# Altium schematic sheet Power_v2.SchDoc
size A
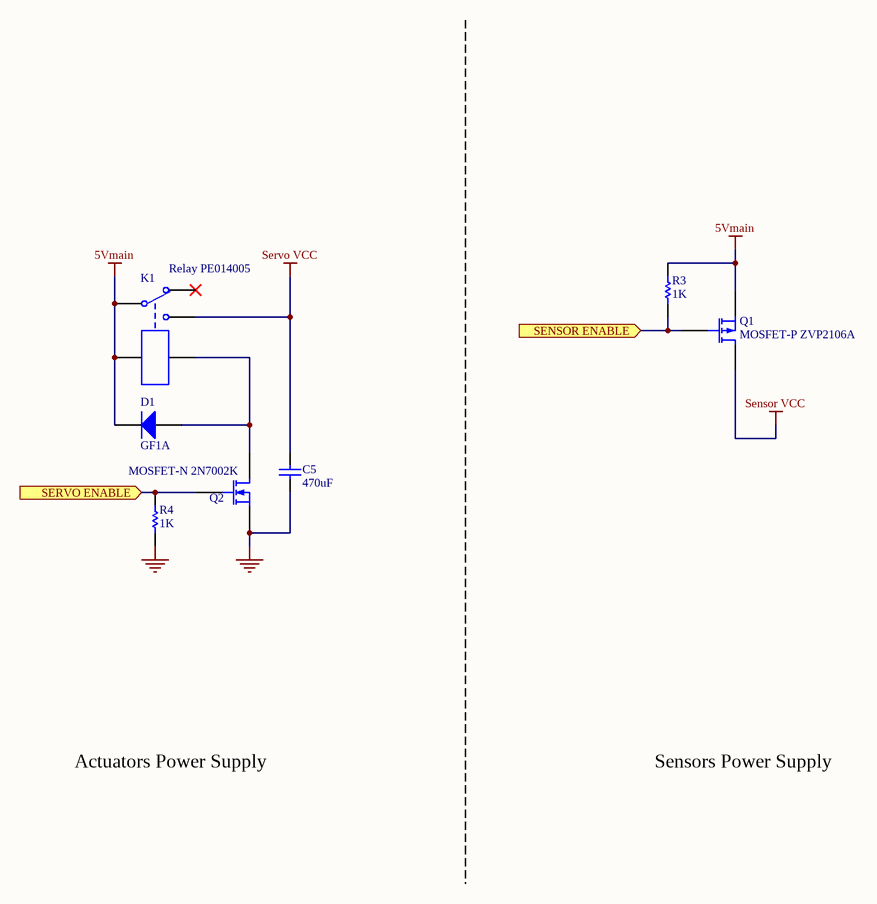
[diagram p0: Power_v2.SchDoc]

## Parts
C5  470uF  [CONDO_D_10mm]
D1  GF1A  [SMA/DO-214AC_21]
K1  Relay PE014005  [PE014005]
Q1  MOSFET-P ZVP2106A  [SOT23]
Q2  MOSFET-N 2N7002K  [SOT23]
R3  1K  [1608 / 0603]
R4  1K  [1608 / 0603]

## Ports
SENSOR ENABLE (in), SERVO ENABLE (in)

## Nets
5Vmain: D1.2(K) K1.12 K1.A2 Q1.3(S) R3.2
GND: C5.1 Q2.2(G) R4.1
Sensor VCC: Q1.1(D)
Servo VCC: C5.2 K1.11
SENSOR ENABLE: Q1.2(G) R3.1 ; port SENSOR ENABLE
SERVO ENABLE: Q2.1(D) R4.2 ; port SERVO ENABLE
NetD1_1: D1.1(A) K1.A1 Q2.3(S)

Not connected (* = marked no-connect by the designer): K1 14*

## Notes on the sheet
- Actuators Power Supply
- Sensors Power Supply

## Library data of the parts
C5 = Cap: Capacitor; fabricant: Panasonic; fournisseur: Farnell; reffabricant: ECA-1EHG471; reffournisseur: 9692843; Published: 8-Jun-2000; LatestRevisionDate: 17-Jul-2002; LatestRevisionNote: Re-released for DXP Platform.; PackageReference: RAD-0.3; Publisher: Altium Limited; PackageDescription: Radial Cap, Thru-Hole; 2 Leads; 0.3 in Pin Spacing
D1 = Diode: Default Diode; fournisseur: Farnell; reffournisseur: 9549560; fabricant: VISHAY; reffabricant: GF1A-E3/67A; Published: 8-Jun-2000; LatestRevisionDate: 17-Jul-2002; LatestRevisionNote: Re-released for DXP Platform.; PackageVersion: Sep-1996; PackageReference: SMC; Publisher: Altium Limited; PackageDescription: DO-214-AB/SMC; 2 C-Bend Leads; Body 7.9 x 5.9 mm, inc. leads (LxW); Code_JEDEC: DO-214-AB
K1 = Relay-SPDT: Relay; fournisseur: Farnell; reffournisseur: 1175088; fabricant: TE CONNECTIVITY / SCHRACK; Published: 24-Mar-1999; LatestRevisionDate: 17-Jul-2002; LatestRevisionNote: Re-released for DXP Platform.; PackageReference: MODULE5B; Publisher: Altium Limited; reffabricant: PE014005
Q1 = MOSFET-P: P-Channel MOSFET; fournisseur: Farnell; reffournisseur: 9525505; fabricant: DIODES INC; Published: 8-Jun-2000; LatestRevisionDate: 17-Jul-2002; LatestRevisionNote: Re-released for DXP Platform.; PackageVersion: 1995/1996; PackageReference: E3; Publisher: Altium Limited; PackageDescription: TO, Flat Index; 3 In-Line, Axial Leads; Body Dia. 4.6mm; Lead Dia. 0.5 mm (max); reffabricant: ZVP2106A
Q2 = MOSFET-N: N-Channel MOSFET; fournisseur: Farnell; reffournisseur: 2453382; fabricant: FAIRCHILD SEMICONDUCTOR; Published: 8-Jun-2000; LatestRevisionDate: 17-Jul-2002; LatestRevisionNote: Re-released for DXP Platform.; PackageVersion: 1995/1996; PackageReference: E3; Publisher: Altium Limited; PackageDescription: TO, Flat Index; 3 In-Line, Axial Leads; Body Dia. 4.6mm; Lead Dia. 0.5 mm (max); reffabricant: 2N7002K
R3 R4 = Res1: Resistor; Published: 8-Jun-2000; LatestRevisionDate: 17-Jul-2002; LatestRevisionNote: Re-released for DXP Platform.; PackageReference: AXIAL-0.3; Publisher: Altium Limited; PackageDescription: Axial Device, Thru-Hole; 2 Leads; 0.3 in Pin Spacing; Value: 1K